# Altium schematic sheet Sheet1.SchDoc
size A2
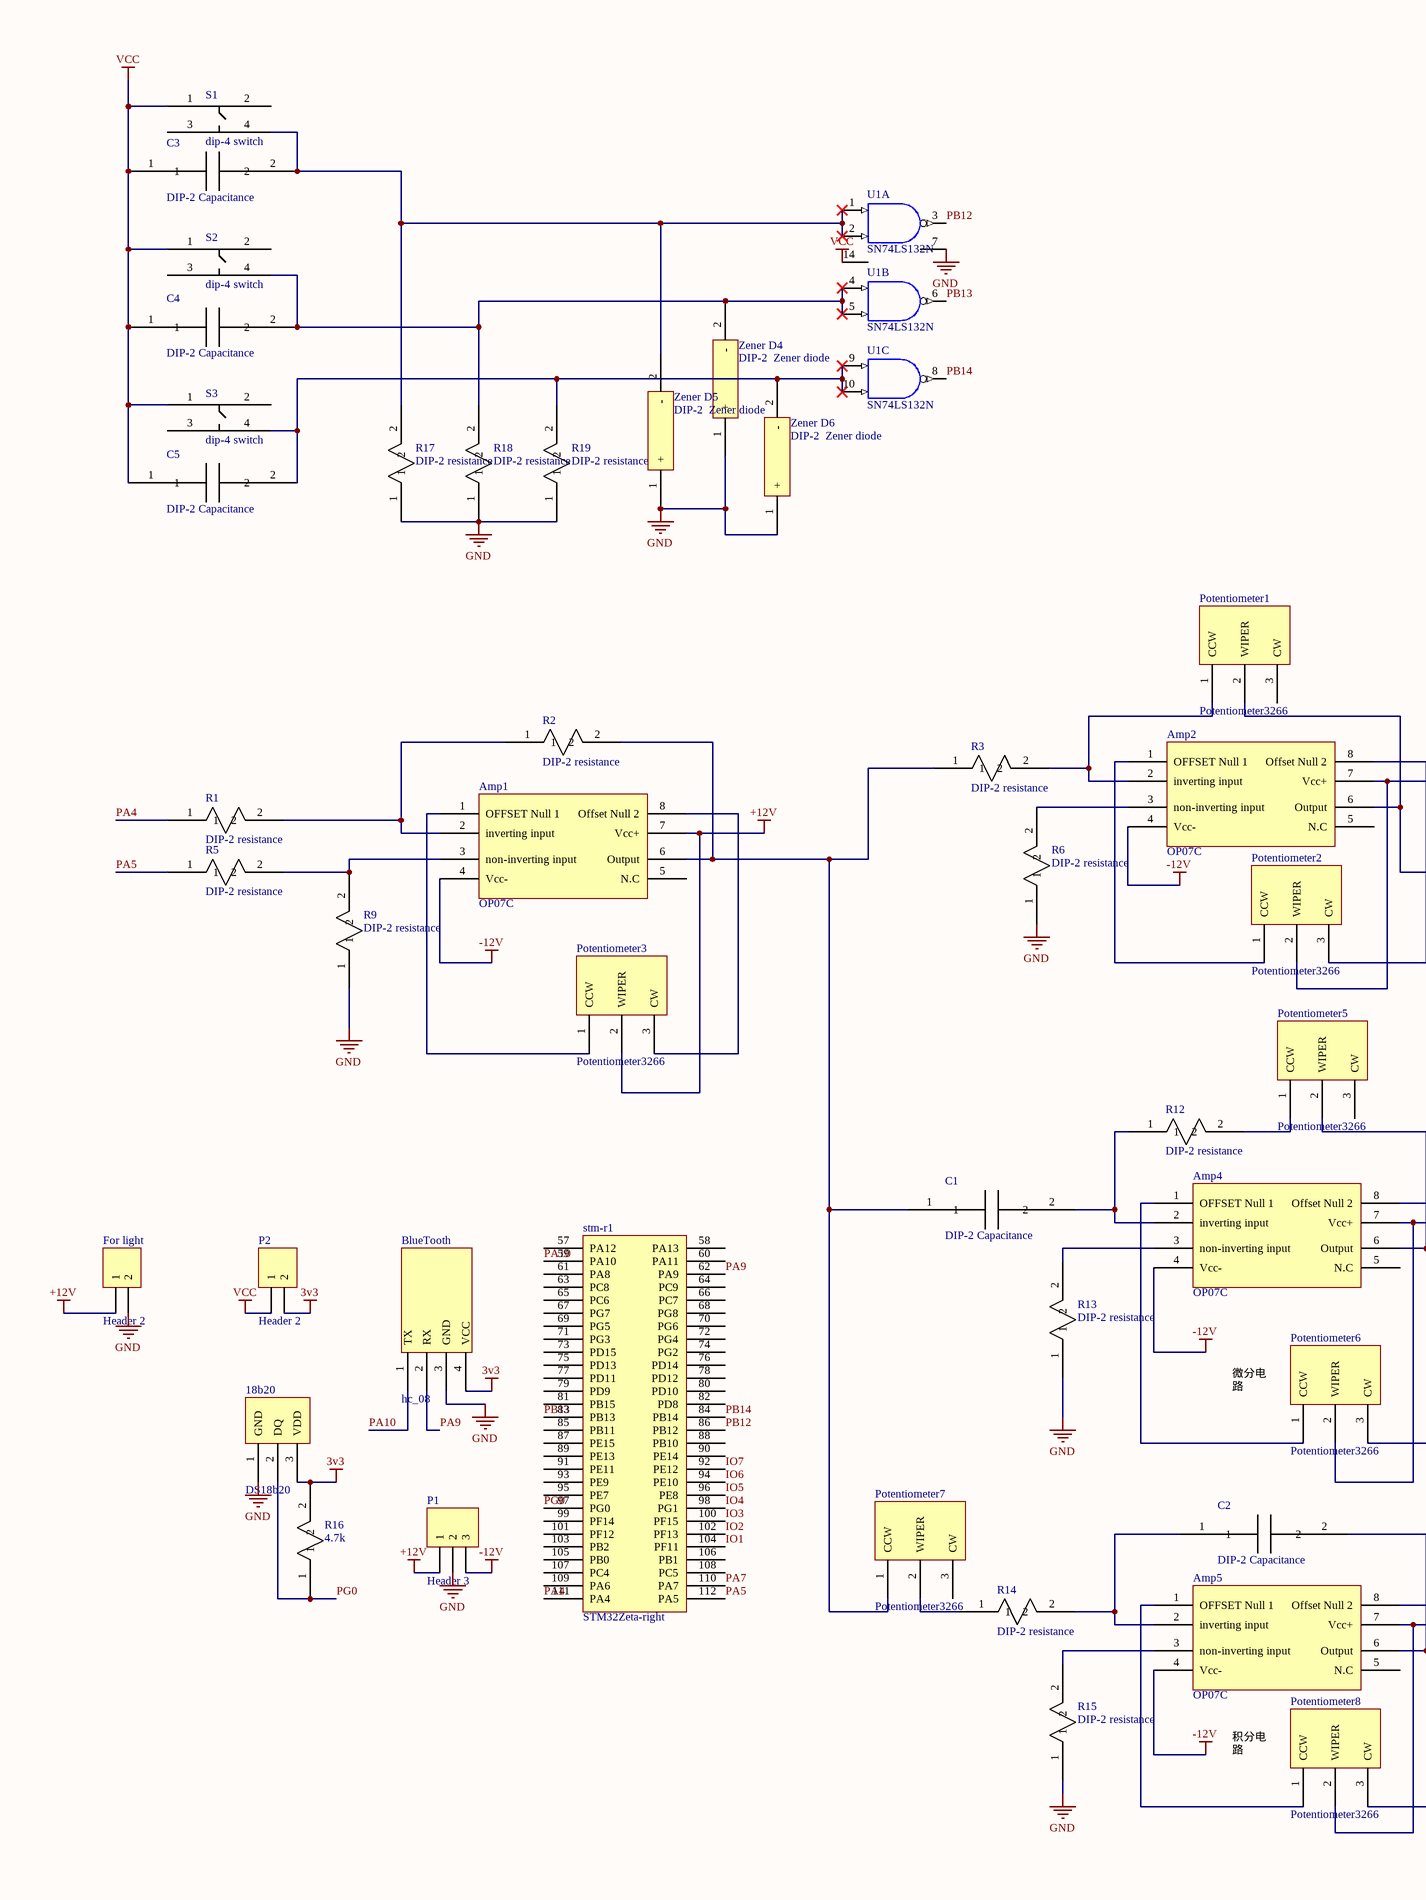
[diagram p0: Sheet1.SchDoc, left]
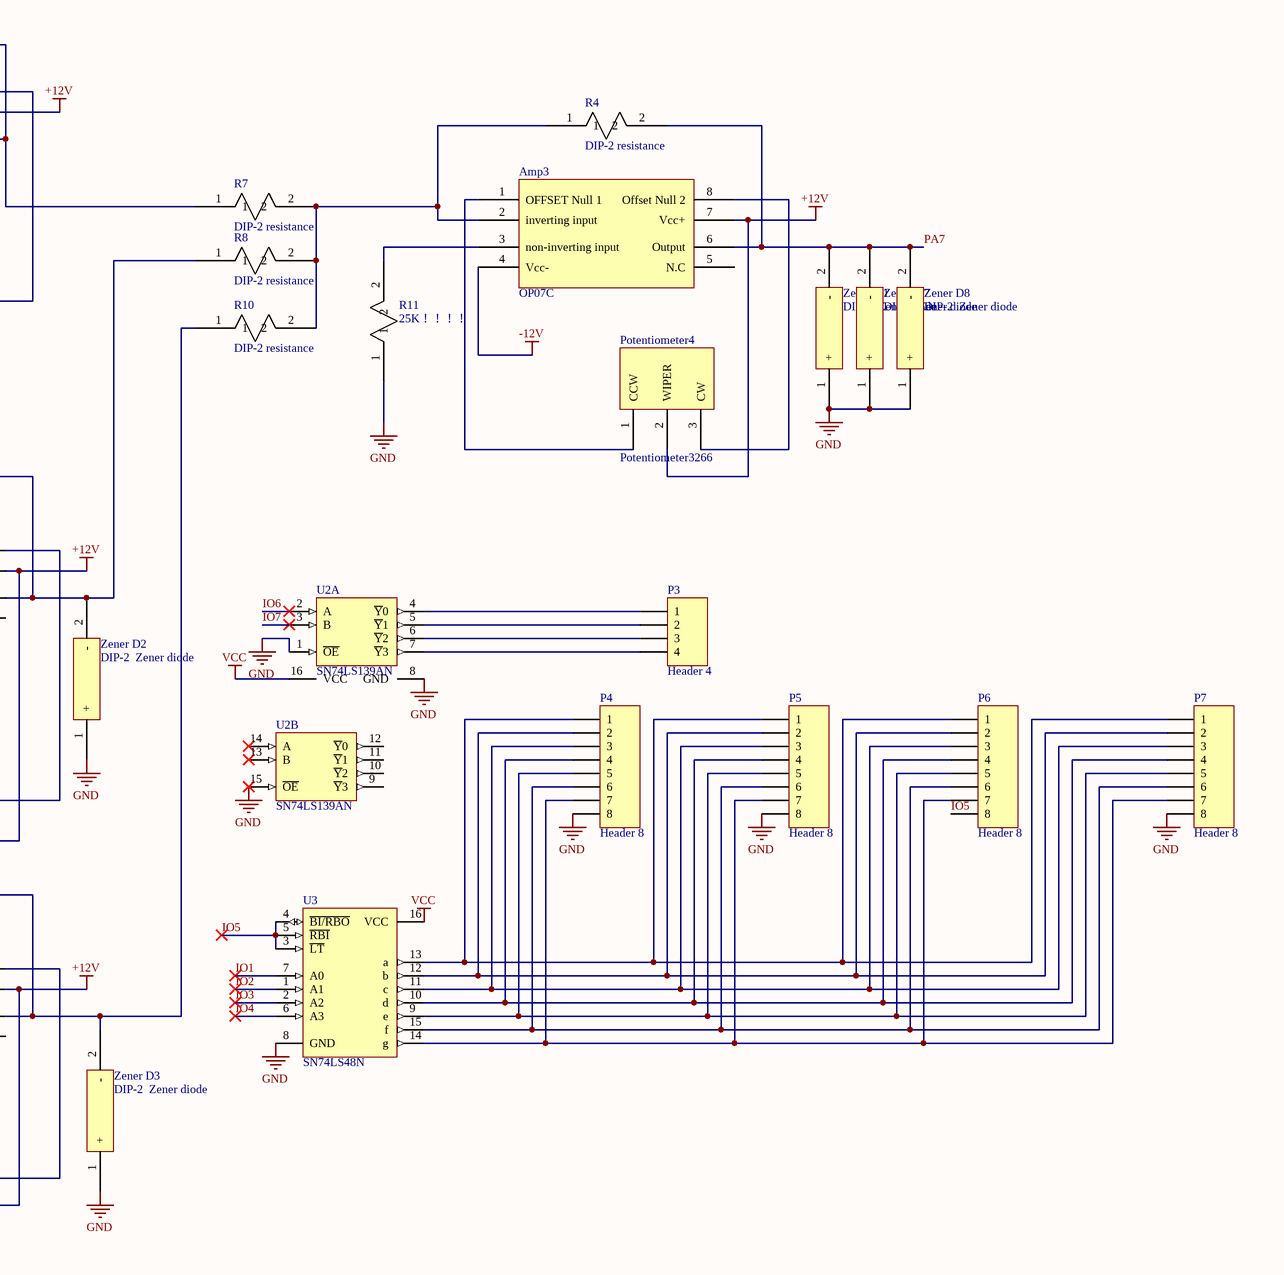
[diagram p1: Sheet1.SchDoc, right]

## Parts
18b20  DS18b20  [DS18b20]
Amp1  OP07C  [OP07C]
Amp2  OP07C  [OP07C]
Amp3  OP07C  [OP07C]
Amp4  OP07C  [OP07C]
Amp5  OP07C  [OP07C]
BlueTooth  hc_08  [hc_08]
C1  DIP-2 Capacitance  [DIP-2 Capacitance]
C2  DIP-2 Capacitance  [DIP-2 Capacitance]
C3  DIP-2 Capacitance  [DIP-2 Capacitance]
C4  DIP-2 Capacitance  [DIP-2 Capacitance]
C5  DIP-2 Capacitance  [DIP-2 Capacitance]
For_light  Header 2  [HDR1X2]
P1  Header 3  [HDR1X3]
P2  Header 2  [HDR1X2]
P3  Header 4  [HDR1X4]
P4  Header 8  [HDR1X8]
P5  Header 8  [HDR1X8]
P6  Header 8  [HDR1X8]
P7  Header 8  [HDR1X8]
Potentiometer1  Potentiometer3266  [Potentiometer3326]
Potentiometer2  Potentiometer3266  [Potentiometer3326]
Potentiometer3  Potentiometer3266  [Potentiometer3326]
Potentiometer4  Potentiometer3266  [Potentiometer3326]
Potentiometer5  Potentiometer3266  [Potentiometer3326]
Potentiometer6  Potentiometer3266  [Potentiometer3326]
Potentiometer7  Potentiometer3266  [Potentiometer3326]
Potentiometer8  Potentiometer3266  [Potentiometer3326]
R1  DIP-2 resistance  [Direct insertion resistance]
R2  DIP-2 resistance  [Direct insertion resistance]
R3  DIP-2 resistance  [Direct insertion resistance]
R4  DIP-2 resistance  [Direct insertion resistance]
R5  DIP-2 resistance  [Direct insertion resistance]
R6  DIP-2 resistance  [Direct insertion resistance]
R7  DIP-2 resistance  [Direct insertion resistance]
R8  DIP-2 resistance  [Direct insertion resistance]
R9  DIP-2 resistance  [Direct insertion resistance]
R10  DIP-2 resistance  [Direct insertion resistance]
R11  25K！！！！  [Direct insertion resistance]
R12  DIP-2 resistance  [Direct insertion resistance]
R13  DIP-2 resistance  [Direct insertion resistance]
R14  DIP-2 resistance  [Direct insertion resistance]
R15  DIP-2 resistance  [Direct insertion resistance]
R16  4.7k  [Direct insertion resistance]
R17  DIP-2 resistance  [Direct insertion resistance]
R18  DIP-2 resistance  [Direct insertion resistance]
R19  DIP-2 resistance  [Direct insertion resistance]
S1  dip-4 switch  [dip4 switch]
S2  dip-4 switch  [dip4 switch]
S3  dip-4 switch  [dip4 switch]
stm-r1  STM32Zeta-right  [STM32zet6-right]
U1  SN74LS132N  [N014]  (parts A,B,C of 4)
U2  SN74LS139AN  [N016]  (parts A,B of 2)
U3  SN74LS48N  [N016D]
Zener_D1  DIP-2  Zener diode  [DIP-2 Zener Diode]
Zener_D2  DIP-2  Zener diode  [DIP-2 Zener Diode]
Zener_D3  DIP-2  Zener diode  [DIP-2 Zener Diode]
Zener_D4  DIP-2  Zener diode  [DIP-2 Zener Diode]
Zener_D5  DIP-2  Zener diode  [DIP-2 Zener Diode]
Zener_D6  DIP-2  Zener diode  [DIP-2 Zener Diode]
Zener_D7  DIP-2  Zener diode  [DIP-2 Zener Diode]
Zener_D8  DIP-2  Zener diode  [DIP-2 Zener Diode]

## Nets
3v3: 18b20.3(VDD) BlueTooth.4(VCC) P2.2 R16.2
+12V: Amp1.7(Vcc+) Amp2.7(Vcc+) Amp3.7(Vcc+) Amp4.7(Vcc+) Amp5.7(Vcc+) For_light.1 P1.1 Potentiometer2.2(WIPER) Potentiometer3.2(WIPER) Potentiometer4.2(WIPER) Potentiometer6.2(WIPER) Potentiometer8.2(WIPER)
-12V: Amp1.4(Vcc-) Amp2.4(Vcc-) Amp3.4(Vcc-) Amp4.4(Vcc-) Amp5.4(Vcc-) P1.3
GND: 18b20.1(GND) BlueTooth.3(GND) For_light.2 P1.2 P4.8 P5.8 P7.8 R6.1 R9.1 R11.1 R13.1 R15.1 R17.1 R18.1 R19.1 U1.7(GND) U2.1(~{OE}) U2.8(GND) U2.15(~{OE}) U3.8(GND) Zener_D1.1(+) Zener_D2.1(+) Zener_D3.1(+) Zener_D4.1(+) Zener_D5.1(+) Zener_D6.1(+) Zener_D7.1(+) Zener_D8.1(+)
VCC: C3.1 C4.1 C5.1 P2.1 S1.1 S2.1 S3.1 U1.14(VCC) U2.16(VCC) U3.16(VCC)
IO1: stm-r1.104(PF11) U3.7(A0)
IO2: stm-r1.102(PF13) U3.1(A1)
IO3: stm-r1.100(PF15) U3.2(A2)
IO4: stm-r1.98(PG1) U3.6(A3)
IO5: P6.8 stm-r1.96(PE8) U3.3(~{LT}) U3.4(~{BI/RBO}) U3.5(~{RBI})
IO6: stm-r1.94(PE10) U2.2(A)
IO7: stm-r1.92(PE12) U2.3(B)
PA4: R1.1 stm-r1.111(PA4)
PA5: R5.1 stm-r1.112(PA5)
PA7: Amp3.6(Output) R4.2 stm-r1.110(PA7) Zener_D1.2(-) Zener_D7.2(-) Zener_D8.2(-)
PA9: BlueTooth.2(RX) stm-r1.62(PA9)
PA10: BlueTooth.1(TX) stm-r1.59(PA10)
PB12: stm-r1.86(PB12) U1.3(Y)
PB13: stm-r1.83(PB13) U1.6(Y)
PB14: stm-r1.84(PB14) U1.8(Y)
PG0: 18b20.2(DQ) R16.1 stm-r1.97(PG0)
NetAmp1_1: Amp1.1(OFFSET_Null_1) Potentiometer3.1(CCW)
NetAmp1_2: Amp1.2(inverting_input) R1.2 R2.1
NetAmp1_3: Amp1.3(non-inverting_input) R5.2 R9.2
NetAmp1_6: Amp1.6(Output) C1.1 Potentiometer7.1(CCW) R2.2 R3.1
NetAmp1_8: Amp1.8(Offset_Null_2) Potentiometer3.3(CW)
NetAmp2_1: Amp2.1(OFFSET_Null_1) Potentiometer2.1(CCW)
NetAmp2_2: Amp2.2(inverting_input) Potentiometer1.1(CCW) R3.2
NetAmp2_3: Amp2.3(non-inverting_input) R6.2
NetAmp2_6: Amp2.6(Output) Potentiometer1.2(WIPER) R7.1
NetAmp2_8: Amp2.8(Offset_Null_2) Potentiometer2.3(CW)
NetAmp3_1: Amp3.1(OFFSET_Null_1) Potentiometer4.1(CCW)
NetAmp3_2: Amp3.2(inverting_input) R4.1 R7.2 R8.2 R10.2
NetAmp3_3: Amp3.3(non-inverting_input) R11.2
NetAmp3_8: Amp3.8(Offset_Null_2) Potentiometer4.3(CW)
NetAmp4_1: Amp4.1(OFFSET_Null_1) Potentiometer6.1(CCW)
NetAmp4_2: Amp4.2(inverting_input) C1.2 R12.1
NetAmp4_3: Amp4.3(non-inverting_input) R13.2
NetAmp4_6: Amp4.6(Output) Potentiometer5.2(WIPER) R8.1 Zener_D2.2(-)
NetAmp4_8: Amp4.8(Offset_Null_2) Potentiometer6.3(CW)
NetAmp5_1: Amp5.1(OFFSET_Null_1) Potentiometer8.1(CCW)
NetAmp5_2: Amp5.2(inverting_input) C2.1 R14.2
NetAmp5_3: Amp5.3(non-inverting_input) R15.2
NetAmp5_6: Amp5.6(Output) C2.2 R10.1 Zener_D3.2(-)
NetAmp5_8: Amp5.8(Offset_Null_2) Potentiometer8.3(CW)
NetC3_2: C3.2 R17.2 S1.4 U1.1(A) U1.2(B) Zener_D5.2(-)
NetC4_2: C4.2 R18.2 S2.4 U1.4(A) U1.5(B) Zener_D4.2(-)
NetC5_2: C5.2 R19.2 S3.4 U1.9(A) U1.10(B) Zener_D6.2(-)
NetP3_1: P3.1 U2.4(~{Y}0)
NetP3_2: P3.2 U2.5(~{Y}1)
NetP3_3: P3.3 U2.6(~{Y}2)
NetP3_4: P3.4 U2.7(~{Y}3)
NetP4_1: P4.1 P5.1 P6.1 P7.1 U3.13(a)
NetP4_2: P4.2 P5.2 P6.2 P7.2 U3.12(b)
NetP4_3: P4.3 P5.3 P6.3 P7.3 U3.11(c)
NetP4_4: P4.4 P5.4 P6.4 P7.4 U3.10(d)
NetP4_5: P4.5 P5.5 P6.5 P7.5 U3.9(e)
NetP4_6: P4.6 P5.6 P6.6 P7.6 U3.15(f)
NetP4_7: P4.7 P5.7 P6.7 P7.7 U3.14(g)
NetPotentiometer5_1: Potentiometer5.1(CCW) R12.2
NetPotentiometer7_2: Potentiometer7.2(WIPER) R14.1

Not connected (* = marked no-connect by the designer): Amp1 5(N.C); Amp2 5(N.C); Amp3 5(N.C); Amp4 5(N.C); Amp5 5(N.C); Potentiometer1 3(CW); Potentiometer5 3(CW); Potentiometer7 3(CW); S1 2 3; S2 2 3; S3 2 3; stm-r1 57(PA12) 58(PA13) 60(PA11) 61(PA8) 63(PC8) 64(PC9) 65(PC6) 66(PC7) 67(PG7) 68(PG8) 69(PG5) 70(PG6) 71(PG3) 72(PG4) 73(PD15) 74(PG2) 75(PD13) 76(PD14) 77(PD11) 78(PD12) 79(PD9) 80(PD10) 81(PB15) 82(PD8) 85(PB11) 87(PE15) 88(PB10) 89(PE13) 90(PE14) 91(PE11) 93(PE9) 95(PE7) 99(PF14) 101(PF12) 103(PB2) 105(PB0) 106(PB1) 107(PC4) 108(PC5) 109(PA6); U2 9(~{Y}3) 10(~{Y}2) 11(~{Y}1) 12(~{Y}0) 13(B)* 14(A)*

## Notes on the sheet
- (near Potentiometer6) 微分电路
- (near Potentiometer8) 积分电路

## Library data of the parts
For_light P2 = Header 2: Header, 2-Pin; LatestRevisionDate: 17-Jul-2002; LatestRevisionNote: Re-released for DXP Platform.; Publisher: Altium Limited
P1 = Header 3: Header, 3-Pin; LatestRevisionDate: 17-Jul-2002; LatestRevisionNote: Re-released for DXP Platform.; Publisher: Altium Limited
P3 = Header 4: Header, 4-Pin; LatestRevisionDate: 17-Jul-2002; LatestRevisionNote: Re-released for DXP Platform.; Publisher: Altium Limited
P4-P7 = Header 8: Header, 8-Pin; LatestRevisionDate: 17-Jul-2002; LatestRevisionNote: Re-released for DXP Platform.; Publisher: Altium Limited
R11 R16 = DIP-2 resistance
U1 = SN74LS132N: Quadruple 2-Input Positive-NAND Schmitt Trigger; Published: 8-Jun-2000; LatestRevisionDate: 04-Mar-2005; LatestRevisionNote: Stylized 3D Model Added.; DatasheetVersion: Mar-1988; PackageVersion: Oct-1995; PackageReference: N014; Publisher: Altium Limited; PackageDescription: DIP; 14 Leads; Row Spacing 7.62 mm; Pitch 2.54 mm; ComponentLink1Description: Manufacturer Link; ComponentLink1URL: http://www.ti.com/; ComponentLink2Description: Datasheet; ComponentLink2URL: http://www-s.ti.com/sc/ds/sn74ls132.pdf
U2 = SN74LS139AN: Dual 2-Line to 4-Line Decoder / Demultiplexer; Published: 8-Jun-2000; LatestRevisionDate: 04-Mar-2005; LatestRevisionNote: Stylized 3D Model Added.; DatasheetVersion: Mar-1988; PackageVersion: Oct-1995; PackageReference: N016; Publisher: Altium Limited; PackageDescription: DIP; 16 Leads; Row Spacing 7.62 mm; Pitch 2.54 mm; Code_JEDEC: MS-001-BB; ComponentLink1Description: Manufacturer Link; ComponentLink1URL: http://www.ti.com/; ComponentLink2Description: Datasheet; ComponentLink2URL: http://www-s.ti.com/sc/ds/sn74ls139a.pdf
U3 = SN74LS48N: BCD-to-Seven-Segment Decoder/Driver; Published: 8-Jun-2000; LatestRevisionDate: 29-May-2009; LatestRevisionNote: Component Body Added.; DatasheetVersion: Mar-1988; PackageVersion: Oct-1995; PackageReference: N016D; Publisher: Altium Limited; PackageDescription: DIP, 16-Pin, Row Spacing 7.62 mm, Pitch 2.54 mm; Code_JEDEC: MS-001-BB; ComponentLink1Description: Manufacturer Link; ComponentLink1URL: http://www.ti.com/